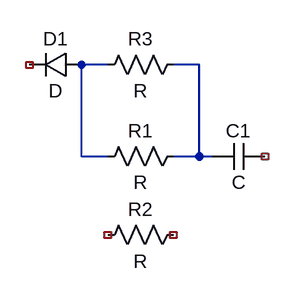
[diagram p0: schematic Gate_Drive.asc]
Gate_Drive.asc, the LTspice schematic file:
Version 4
SHEET 1 880 680
WIRE 48 0 16 0
WIRE 160 0 128 0
WIRE 16 112 16 0
WIRE 48 112 16 112
WIRE 160 112 160 0
WIRE 160 112 128 112
WIRE 176 112 160 112
SYMBOL res 144 96 R90
WINDOW 0 0 56 VBottom 2
WINDOW 3 32 56 VTop 2
SYMATTR InstName R1
SYMBOL res 144 192 R90
WINDOW 0 0 56 VBottom 2
WINDOW 3 32 56 VTop 2
SYMATTR InstName R2
SYMBOL res 144 -16 R90
WINDOW 0 0 56 VBottom 2
WINDOW 3 32 56 VTop 2
SYMATTR InstName R3
SYMBOL diode 16 -16 R90
WINDOW 0 0 32 VBottom 2
WINDOW 3 32 32 VTop 2
SYMATTR InstName D1
SYMBOL cap 240 96 R90
WINDOW 0 0 32 VBottom 2
WINDOW 3 32 32 VTop 2
SYMATTR InstName C1

The netlist it stands for:
* Gate_Drive.asc
R1 N002 N001 R
R2 NC_01 NC_02 R
R3 N002 N001 R
D1 N001 NC_03 D
C1 NC_04 N002 C
.model D D
.lib standard.dio
.backanno
.end